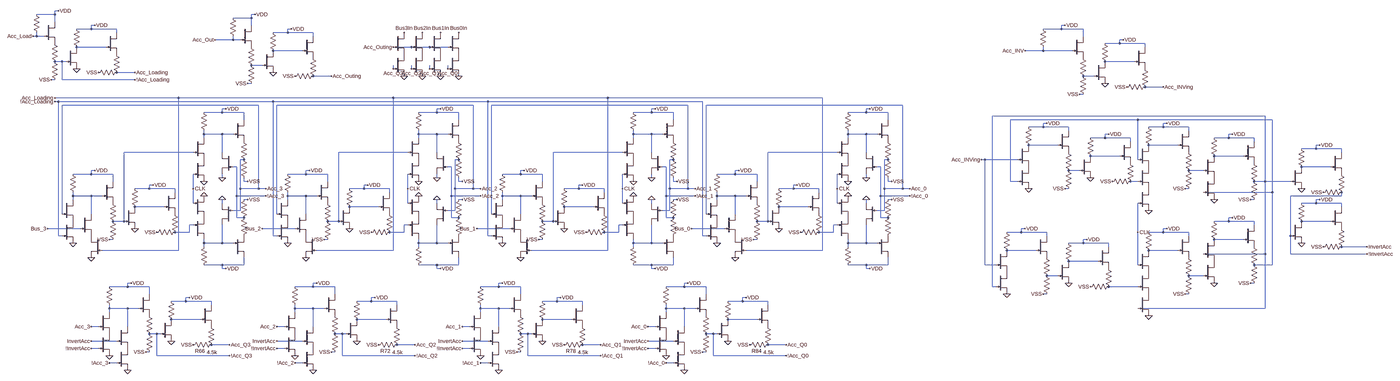
[diagram p0: schematic alu_acc_4bit.asc, whole sheet]
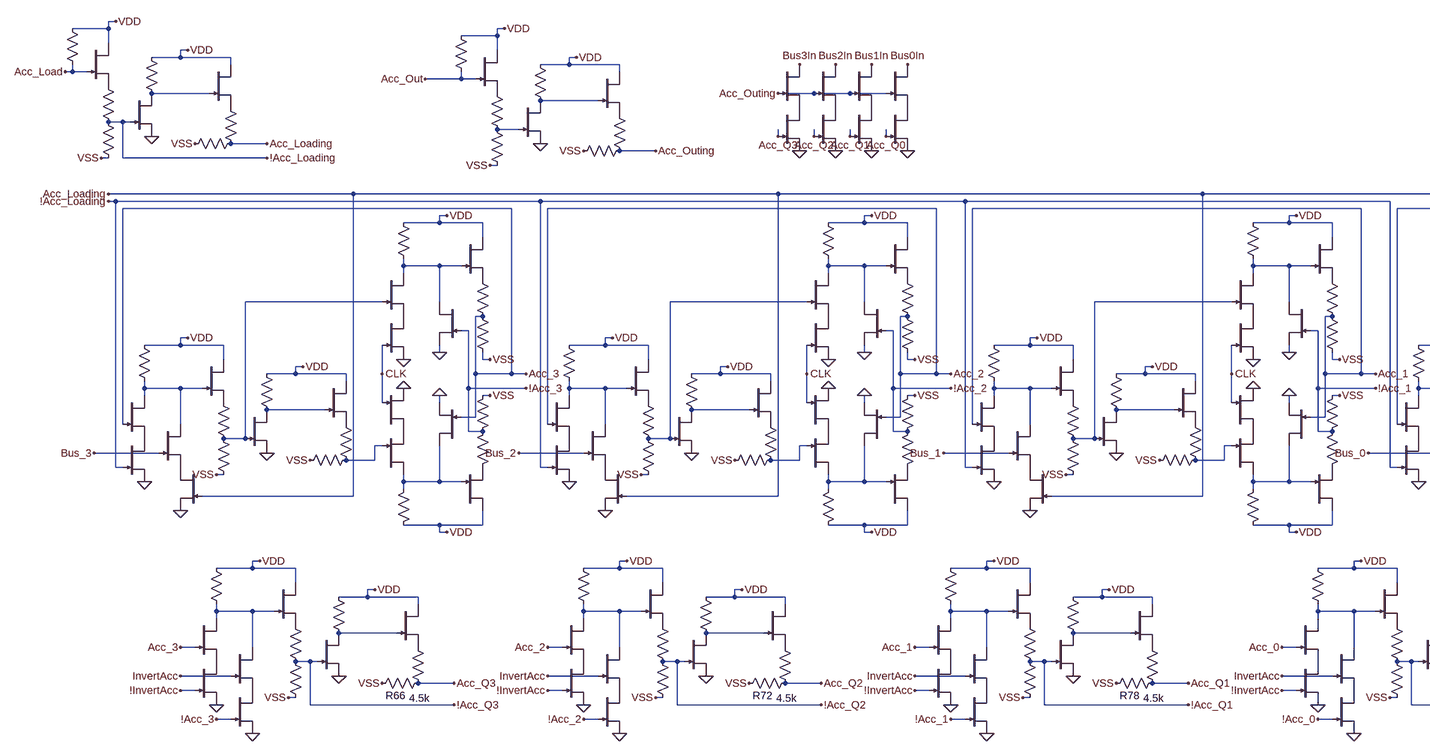
[diagram p1: schematic alu_acc_4bit.asc, part, row 1 of 1, column 1 of 2]
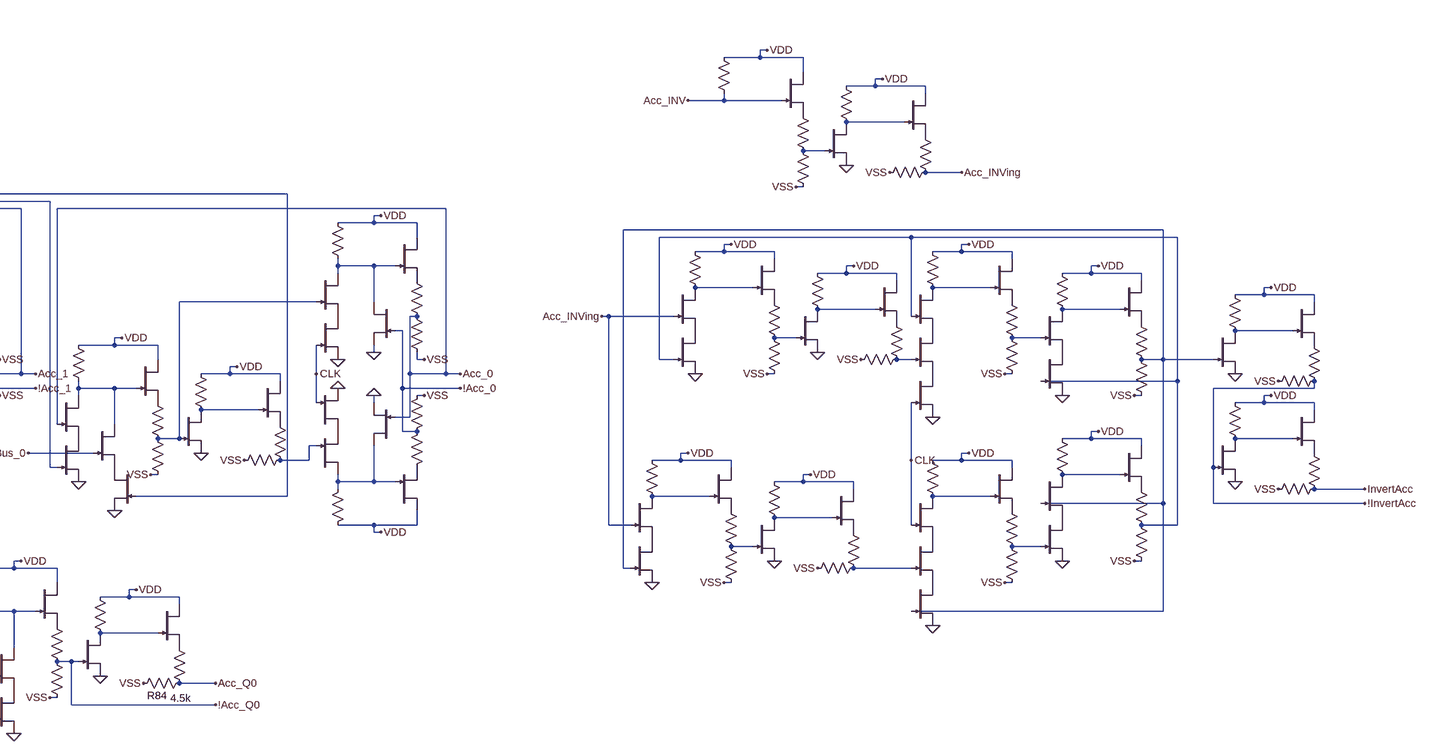
[diagram p2: schematic alu_acc_4bit.asc, part, row 1 of 1, column 2 of 2]
* alu_acc_4bit.asc
R1 VDD Acc_Load 100k
J_F1 VDD Acc_Load P001 DR
R2 P001 !Acc_Loading 1k
R3 !Acc_Loading VSS 4.8k
J_A1 N001 !Acc_Loading 0 DR
R4 VDD N001 50k
J_A2 VDD N001 P002 DR
R5 P002 Acc_Loading 1k
R6 Acc_Loading VSS 4.5k
R7 VDD Acc_Out 100k
J_F2 VDD Acc_Out P003 DR
R8 P003 N003 1k
R9 N003 VSS 4.8k
J_A3 N002 N003 0 DR
R10 VDD N002 50k
J_A4 VDD N002 P004 DR
R11 P004 Acc_Outing 1k
R12 Acc_Outing VSS 4.5k
J_A5 N004 N005 P005 DR
R13 VDD N004 100k
J_F3 VDD N004 P006 DR
R14 P006 Acc_3 1k
R15 Acc_3 VSS 4.8k
J_B1 N004 !Acc_3 0 DR
J_A6 N009 N008 P007 DR
R16 VDD N009 100k
J_F4 VDD N009 P008 DR
R17 P008 !Acc_3 1k
R18 !Acc_3 VSS 4.8k
J_B2 N009 Acc_3 0 DR
J_A7 P005 CLK 0 DR
J_A8 P007 CLK 0 DR
J_A9 N006 Acc_3 P009 DR
R19 VDD N006 100k
J_F5 VDD N006 P010 DR
R20 P010 N005 1k
R21 N005 VSS 4.8k
J_B3 N006 Bus_3 P011 DR
J_A10 N007 N005 0 DR
R22 VDD N007 50k
J_A11 VDD N007 P012 DR
R23 P012 N008 1k
R24 N008 VSS 4.5k
J_A12 P009 !Acc_Loading 0 DR
J_B4 P011 Acc_Loading 0 DR
J_A13 N010 N011 P013 DR
R25 VDD N010 100k
J_F6 VDD N010 P014 DR
R26 P014 Acc_2 1k
R27 Acc_2 VSS 4.8k
J_B5 N010 !Acc_2 0 DR
J_A14 N015 N014 P015 DR
R28 VDD N015 100k
J_F7 VDD N015 P016 DR
R29 P016 !Acc_2 1k
R30 !Acc_2 VSS 4.8k
J_B6 N015 Acc_2 0 DR
J_A15 P013 CLK 0 DR
J_A16 P015 CLK 0 DR
J_A17 N012 Acc_2 P017 DR
R31 VDD N012 100k
J_F8 VDD N012 P018 DR
R32 P018 N011 1k
R33 N011 VSS 4.8k
J_B7 N012 Bus_2 P019 DR
J_A18 N013 N011 0 DR
R34 VDD N013 50k
J_A19 VDD N013 P020 DR
R35 P020 N014 1k
R36 N014 VSS 4.5k
J_A20 P017 !Acc_Loading 0 DR
J_B8 P019 Acc_Loading 0 DR
J_A21 N016 N017 P021 DR
R37 VDD N016 100k
J_F9 VDD N016 P022 DR
R38 P022 Acc_1 1k
R39 Acc_1 VSS 4.8k
J_B9 N016 !Acc_1 0 DR
J_A22 N021 N020 P023 DR
R40 VDD N021 100k
J_F10 VDD N021 P024 DR
R41 P024 !Acc_1 1k
R42 !Acc_1 VSS 4.8k
J_B10 N021 Acc_1 0 DR
J_A23 P021 CLK 0 DR
J_A24 P023 CLK 0 DR
J_A25 N018 Acc_1 P025 DR
R43 VDD N018 100k
J_F11 VDD N018 P026 DR
R44 P026 N017 1k
R45 N017 VSS 4.8k
J_B11 N018 Bus_1 P027 DR
J_A26 N019 N017 0 DR
R46 VDD N019 50k
J_A27 VDD N019 P028 DR
R47 P028 N020 1k
R48 N020 VSS 4.5k
J_A28 P025 !Acc_Loading 0 DR
J_B12 P027 Acc_Loading 0 DR
J_A29 N022 N023 P029 DR
R49 VDD N022 100k
J_F12 VDD N022 P030 DR
R50 P030 Acc_0 1k
R51 Acc_0 VSS 4.8k
J_B13 N022 !Acc_0 0 DR
J_A30 N027 N026 P031 DR
R52 VDD N027 100k
J_F13 VDD N027 P032 DR
R53 P032 !Acc_0 1k
R54 !Acc_0 VSS 4.8k
J_B14 N027 Acc_0 0 DR
J_A31 P029 CLK 0 DR
J_A32 P031 CLK 0 DR
J_A33 N024 Acc_0 P033 DR
R55 VDD N024 100k
J_F14 VDD N024 P034 DR
R56 P034 N023 1k
R57 N023 VSS 4.8k
J_B15 N024 Bus_0 P035 DR
J_A34 N025 N023 0 DR
R58 VDD N025 50k
J_A35 VDD N025 P036 DR
R59 P036 N026 1k
R60 N026 VSS 4.5k
J_A36 P033 !Acc_Loading 0 DR
J_B16 P035 Acc_Loading 0 DR
J_BUS1 P037 Acc_Q3 0 DR
J_BUS2 Bus3In Acc_Outing P037 DR
J_BUS3 P038 Acc_Q2 0 DR
J_BUS4 Bus2In Acc_Outing P038 DR
J_BUS5 P039 Acc_Q1 0 DR
J_BUS6 Bus1In Acc_Outing P039 DR
J_BUS7 P040 Acc_Q0 0 DR
J_BUS8 Bus0In Acc_Outing P040 DR
J_A37 N028 Acc_3 P041 DR
R61 VDD N028 100k
J_F15 VDD N028 P042 DR
R62 P042 !Acc_Q3 1k
R63 !Acc_Q3 VSS 4.8k
J_B17 N028 InvertAcc P043 DR
J_A38 N029 !Acc_Q3 0 DR
R64 VDD N029 50k
J_A39 VDD N029 P044 DR
R65 P044 Acc_Q3 1k
R66 Acc_Q3 VSS 4.5k
J_A40 P041 !InvertAcc 0 DR
J_B18 P043 !Acc_3 0 DR
J_A41 N030 Acc_2 P045 DR
R67 VDD N030 100k
J_F16 VDD N030 P046 DR
R68 P046 !Acc_Q2 1k
R69 !Acc_Q2 VSS 4.8k
J_B19 N030 InvertAcc P047 DR
J_A42 N031 !Acc_Q2 0 DR
R70 VDD N031 50k
J_A43 VDD N031 P048 DR
R71 P048 Acc_Q2 1k
R72 Acc_Q2 VSS 4.5k
J_A44 P045 !InvertAcc 0 DR
J_B20 P047 !Acc_2 0 DR
J_A45 N032 Acc_1 P049 DR
R73 VDD N032 100k
J_F17 VDD N032 P050 DR
R74 P050 !Acc_Q1 1k
R75 !Acc_Q1 VSS 4.8k
J_B21 N032 InvertAcc P051 DR
J_A46 N033 !Acc_Q1 0 DR
R76 VDD N033 50k
J_A47 VDD N033 P052 DR
R77 P052 Acc_Q1 1k
R78 Acc_Q1 VSS 4.5k
J_A48 P049 !InvertAcc 0 DR
J_B22 P051 !Acc_1 0 DR
J_A49 N034 Acc_0 P053 DR
R79 VDD N034 100k
J_F18 VDD N034 P054 DR
R80 P054 !Acc_Q0 1k
R81 !Acc_Q0 VSS 4.8k
J_B23 N034 InvertAcc P055 DR
J_A50 N035 !Acc_Q0 0 DR
R82 VDD N035 50k
J_A51 VDD N035 P056 DR
R83 P056 Acc_Q0 1k
R84 Acc_Q0 VSS 4.5k
J_A52 P053 !InvertAcc 0 DR
J_B24 P055 !Acc_0 0 DR
R85 VDD Acc_INV 100k
J_F19 VDD Acc_INV P057 DR
R86 P057 N037 1k
R87 N037 VSS 4.8k
J_A53 N036 N037 0 DR
R88 VDD N036 50k
J_A54 VDD N036 P058 DR
R89 P058 Acc_INVing 1k
R90 Acc_INVing VSS 4.5k
J_A55 N040 Acc_INVing P059 DR
R91 VDD N040 100k
J_F20 VDD N040 P060 DR
R92 P060 N045 1k
R93 N045 VSS 4.8k
J_B25 P059 N039 0 DR
J_A56 N042 N045 0 DR
R94 VDD N042 50k
J_F21 VDD N042 P061 DR
R95 P061 N047 1k
R96 N047 VSS 4.5k
J_A57 N050 Acc_INVing P062 DR
R97 VDD N050 100k
J_F22 VDD N050 P063 DR
R98 P063 N053 1k
R99 N053 VSS 4.8k
J_B26 P062 N038 0 DR
J_A58 N052 N053 0 DR
R100 VDD N052 50k
J_F23 VDD N052 P064 DR
R101 P064 N055 1k
R102 N055 VSS 4.5k
J_A59 N041 N039 P065 DR
R103 VDD N041 100k
J_F24 VDD N041 P066 DR
R104 P066 N046 1k
R105 N046 VSS 4.8k
J_B27 P065 N047 P067 DR
J_A60 N051 CLK P068 DR
R106 VDD N051 100k
J_F25 VDD N051 P069 DR
R107 P069 N054 1k
R108 N054 VSS 4.8k
J_B28 P068 N055 P070 DR
J_A61 N043 N046 P071 DR
R109 VDD N043 100k
J_F26 VDD N043 P072 DR
R110 P072 N038 1k
R111 N038 VSS 4.8k
J_B29 P071 N039 0 DR
J_A62 N049 N038 P073 DR
R112 VDD N049 100k
J_F27 VDD N049 P074 DR
R113 P074 N039 1k
R114 N039 VSS 4.8k
J_B30 P073 N054 0 DR
J_B31 P067 CLK 0 DR
J_B32 P070 N038 0 DR
J_A63 N044 N038 0 DR
R115 VDD N044 50k
J_F28 VDD N044 P075 DR
R116 P075 !InvertAcc 1k
R117 !InvertAcc VSS 4.5k
J_A64 N048 !InvertAcc 0 DR
R118 VDD N048 50k
J_F29 VDD N048 P076 DR
R119 P076 InvertAcc 1k
R120 InvertAcc VSS 4.5k
.model NJF NJF
.model PJF PJF
.lib standard.jft
.backanno
.end